# EAGLE design povbadgeUSB-SMT (EAGLE 6.2)
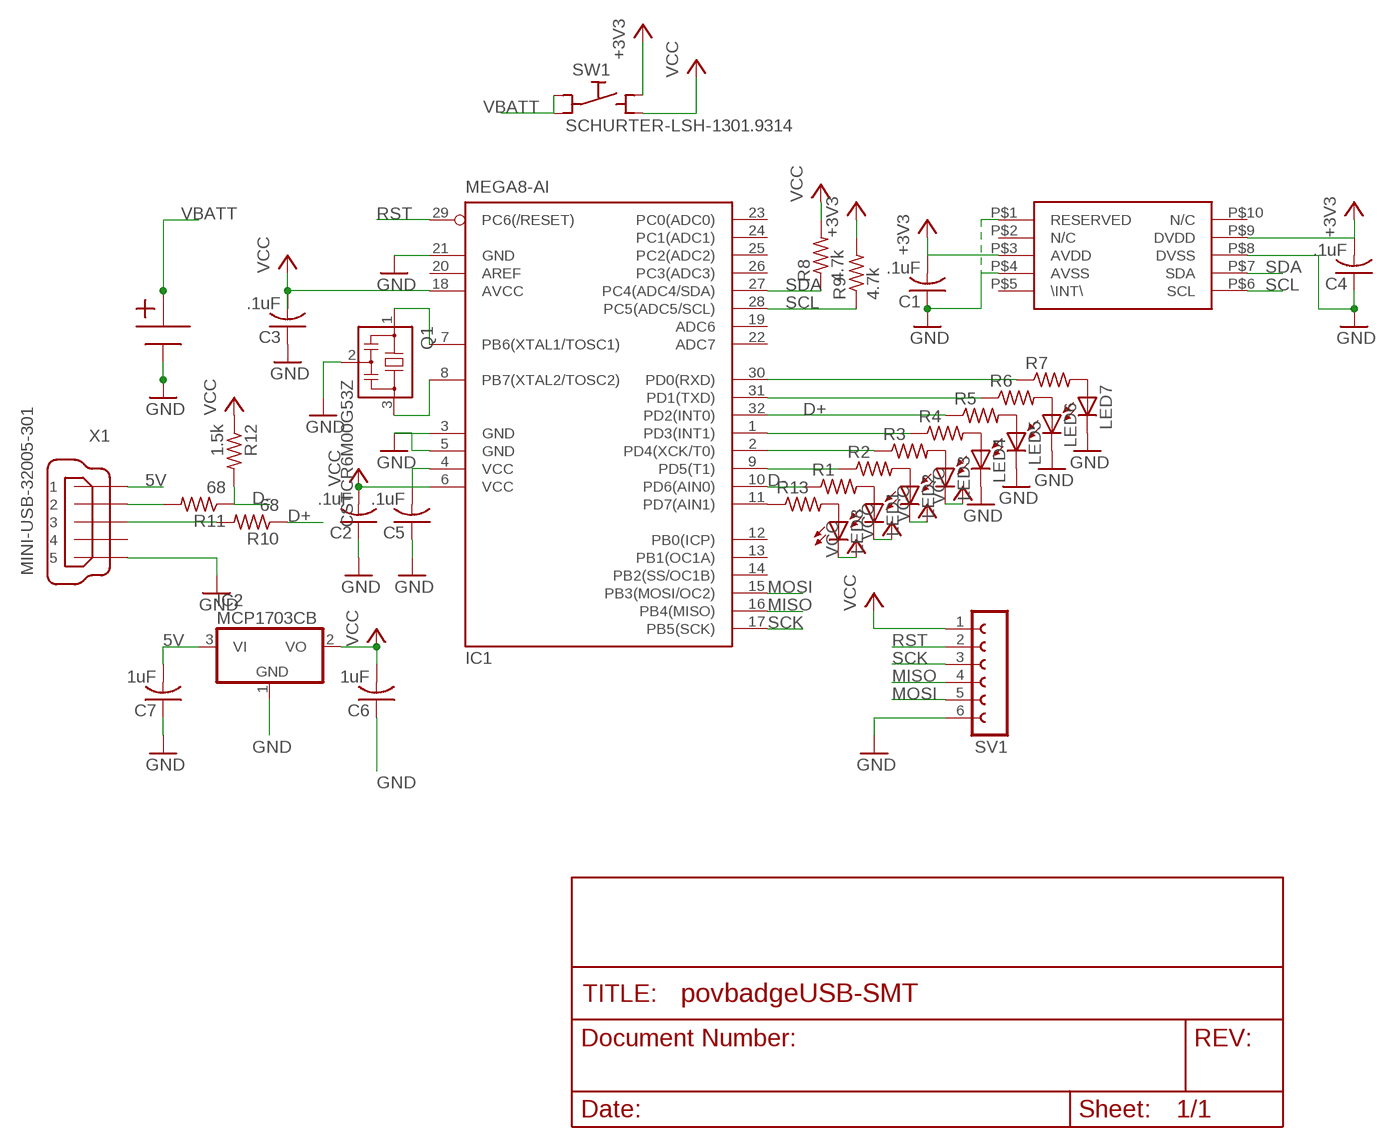
[diagram p0: schematic, sheet 1]

## Parts
C1  .1uF  C-USC0805  [C0805]
C2  .1uF  C-USC0805  [C0805]
C3  .1uF  C-USC0805  [C0805]
C4  .1uF  C-USC0805  [C0805]
C5  .1uF  C-USC0805  [C0805]
C6  1uF  C-USC0805  [C0805]
C7  1uF  C-USC0805  [C0805]
IC1  MEGA8-AI  [TQFP32-08]
IC2  MCP1703CB  [SOT23]
LED1  LEDCHIPLED_0805  [CHIPLED_0805]
LED2  LEDCHIPLED_0805  [CHIPLED_0805]
LED3  LEDCHIPLED_0805  [CHIPLED_0805]
LED4  LEDCHIPLED_0805  [CHIPLED_0805]
LED5  LEDCHIPLED_0805  [CHIPLED_0805]
LED6  LEDCHIPLED_0805  [CHIPLED_0805]
LED7  LEDCHIPLED_0805  [CHIPLED_0805]
LED8  LEDCHIPLED_0805  [CHIPLED_0805]
MMA7660  MMA7660  MMA7660DFN-10-HAND  [DFN-10-HAND]
Q1  CSTCR6M00G53Z  [CSTCR6M]
R1  R-US_R0805  [R0805]
R2  R-US_R0805  [R0805]
R3  R-US_R0805  [R0805]
R4  R-US_R0805  [R0805]
R5  R-US_R0805  [R0805]
R6  R-US_R0805  [R0805]
R7  R-US_R0805  [R0805]
R8  4.7k  R-US_R0805  [R0805]
R9  4.7k  R-US_R0805  [R0805]
R10  68  R-US_R0805  [R0805]
R11  68  R-US_R0805  [R0805]
R12  1.5k  R-US_R0805  [R0805]
R13  R-US_R0805  [R0805]
SV1  FE06W  [FE06W]
SW1  SCHURTER-LSH-1301.9314  [LSH]
U$1  CR2032-CLIP  [CR2032]
X1  MINI-USB-32005-301  [32005-301]

## Nets
5V: C7.2 IC2.3(VI) X1.1
+3V3: C1.2 C4.2 MMA7660.P$3(AVDD) MMA7660.P$9(DVDD) R9.2 SW1.NO1(NO)
D+: IC1.32(PD2(INT0)) R5.1 R10.1
D-: IC1.10(PD6(AIN0)) R1.1 R11.1 R12.2
GND: C1.1 C2.1 C3.1 C4.1 C5.1 C6.1 C7.1 IC1.3(GND) IC1.5(GND) IC1.21(GND) IC2.1(GND) LED4.C LED5.C LED6.C LED7.C MMA7660.P$1(RESERVED) MMA7660.P$4(AVSS) MMA7660.P$8(DVSS) Q1.2 SV1.6 U$1.P$3 X1.5
INT1: IC1.1(PD3(INT1)) R4.1
MISO: IC1.16(PB4(MISO)) SV1.4
MOSI: IC1.15(PB3(MOSI/OC2)) SV1.5
N$1: LED1.A R1.2
N$2: IC1.11(PD7(AIN1)) R13.1
N$3: IC1.8(PB7(XTAL2/TOSC2)) Q1.3
N$4: IC1.7(PB6(XTAL1/TOSC1)) Q1.1
N$5: IC1.9(PD5(T1)) R2.1
N$6: LED8.A R13.2
N$7: LED2.A R2.2
N$8: LED3.A R3.2
N$9: LED4.A R4.2
N$10: LED5.A R5.2
N$11: LED6.A R6.2
N$12: LED7.A R7.2
N$15: R11.2 X1.2
N$16: R10.2 X1.3
RST: IC1.29(PC6(/RESET)) SV1.2
RXD: IC1.30(PD0(RXD)) R7.1
SCK: IC1.17(PB5(SCK)) SV1.3
SCL: IC1.28(PC5(ADC5/SCL)) MMA7660.P$6(SCL) R9.1
SDA: IC1.27(PC4(ADC4/SDA)) MMA7660.P$7(SDA) R8.1
TXD: IC1.31(PD1(TXD)) R6.1
VBATT: SW1.C1(C) SW1.C2(C) U$1.P$1
VCC: C2.2 C3.2 C5.2 C6.2 IC1.4(VCC) IC1.6(VCC) IC1.18(AVCC) IC2.2(VO) LED1.C LED2.C LED3.C LED8.C R8.2 R12.1 SV1.1 SW1.NO2(NO)
XCK: IC1.2(PD4(XCK/T0)) R3.1
Unconnected: IC1.12(PB0(ICP)) IC1.13(PB1(OC1A)) IC1.14(PB2(SS/OC1B)) IC1.19(ADC6) IC1.20(AREF) IC1.22(ADC7) IC1.23(PC0(ADC0)) IC1.24(PC1(ADC1)) IC1.25(PC2(ADC2)) IC1.26(PC3(ADC3)) MMA7660.P$2(N/C) MMA7660.P$5(\INT\) MMA7660.P$10(N/C) U$1.P$2 X1.4

## Library data of the parts
C1-C7 = rcl:C-US: CAPACITOR, American symbol
IC1 = atmel:MEGA8: MICROCONTROLLER 8 Kbytes FLASH, 1 kbytes SRAM, 512 bytes EEPROM, USART, 6-channel 10 bit ADC, 2-channel 8 bit ADC Pin compatible with Atmega48, ATMega88, ATMega168 Source: avr.lbr
IC2 = linear:MCP1703: 250 mA, 16V, Low Quiescent Current LDO Regulator Source: http://ww1.microchip.com/downloads/en/DeviceDoc/22049b.pdf
LED1-LED8 = led:LED: LED OSRAM: - CHIPLED LG R971, LG N971, LY N971, LG Q971, LY Q971, LO R971, LY R971 LH N974, LH R974 LS Q976, LO Q976, LY Q976 LO Q996 - Hyper CHIPLED LW Q18S LB Q993, LB Q99A, LB R99A - SideLED LS A670, LO A670, LY A670, LG A670, LP A670 LB A673, LV A673, LT A673, LW A673 LH A674 LY A675 LS A676, LA A676, LO A676, LY A676, LW A676 LS A679, LY A679, LG A679 - Hyper Micro SIDELED® LS Y876, LA Y876, LO Y876, LY Y876 LT Y87S - SmartLED LW L88C, LW L88S LB L89C, LB L89S, LG L890 LS L89K, LO L89K, LY L89K LS L896, LA L896, LO L896, LY L896 - TOPLED LS T670, LO T670, LY T670, LG T670, LP T670 LSG T670, LSP T670, LSY T670, LOP T670, LYG T670 LG T671, LOG T671, LSG T671 LB T673, LV T673, LT T673, LW T673 LH T674 LS T676, LA T676, LO T676, LY T676, LB T676, LH T676, LSB T676, LW T676 LB T67C, LV T67C, LT T67C, LS T67K, LO T67K, LY T67K, LW E67C LS E67B, LA E67B, LO E67B, LY E67B, LB E67C, LV E67C, LT E67C LW T67C LS T679, LY T679, LG T679 LS T770, LO T770, LY T770, LG T770, LP T770 LB T773, LV T773, LT T773, LW T773 LH T774 LS E675, LA E675, LY E675, LS T675 LS T776, LA T776, LO T776, LY T776, LB T776 LHGB T686 LT T68C, LB T68C - Hyper Mini TOPLED® LB M676 - Mini TOPLED Santana® LG M470 LS M47K, LO M47K, LY M47K Source: http://www.osram.convergy.de LUXEON: - LUMILED® LXK2-PW12-R00, LXK2-PW12-S00, LXK2-PW14-U00, LXK2-PW14-V00 LXK2-PM12-R00, LXK2-PM12-S00, LXK2-PM14-U00 LXK2-PE12-Q00, LXK2-PE12-R00, LXK2-PE12-S00, LXK2-PE14-T00, LXK2-PE14-U00 LXK2-PB12-K00, LXK2-PB12-L00, LXK2-PB12-M00, LXK2-PB14-N00, LXK2-PB14-P00, LXK2-PB14-Q00 LXK2-PR12-L00, LXK2-PR12-M00, LXK2-PR14-Q00, LXK2-PR14-R00 LXK2-PD12-Q00, LXK2-PD12-R00, LXK2-PD12-S00 LXK2-PH12-R00, LXK2-PH12-S00 LXK2-PL12-P00, LXK2-PL12-Q00, LXK2-PL12-R00 Source: www.luxeon.com KINGBRIGHT: KA-3528ASYC Source: www.kingbright.com
MMA7660 = mma7660:MMA7660
Q1 = murata-resonator:CSTCR: Resonator Source: murata.co.jp
R1-R13 = rcl:R-US_: RESISTOR, American symbol
SV1 = con-lsta:FE06W: FEMALE HEADER
SW1 = schurter_switches_LSH_SMS:SCHURTER-LSH-*: Schurter LSH Printmount Switches, Gullwing Leads Momentary Action: Normally Open (NO) 6.0 x 6.0 mm Body Dim. Actuator Diam. mm / Overall Height mm / Schurter # -------------------------------------------------------------- 3.40 / 4.30 / 1301.9314.xx 3.40 / 4.30 / 1301.9315.xx 3.20 / 7.00 / 1301.9316.xx 3.30 / 7.30 / 1301.9317.xx 3.10 / 8.00 / 1301.9319.xx 3.00 / 12.5 / 1301.9320.xx xx: denotes packaging, see Schurter data sheets Author: Dipl.-Ing. FH Rainer Bayer Hochschule Heilbronn HHN: rainer.bayer@hs-heilbronn.de | http://mitarbeiter.hs-heilbronn.de/~rbayer/ Ingenieurbüro ing-rb: mail@ing-rb.de | http://www.ing-rb.de/
U$1 = Battery:CR2032-CLIP
X1 = con-cypressindustries:MINI-USB-: MINI USB-B Conector Source: www.cypressindustries.com; OC_FARNELL: unknown; OC_NEWARK: unknown

## Board
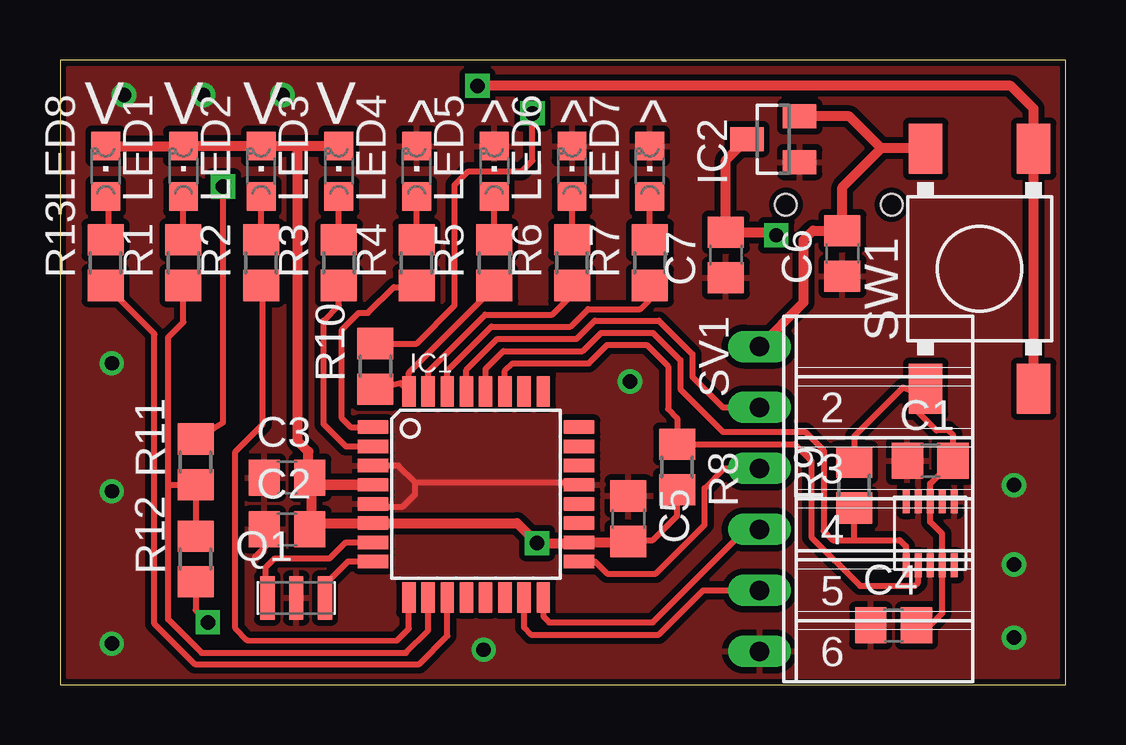
[diagram p1: board, top side]
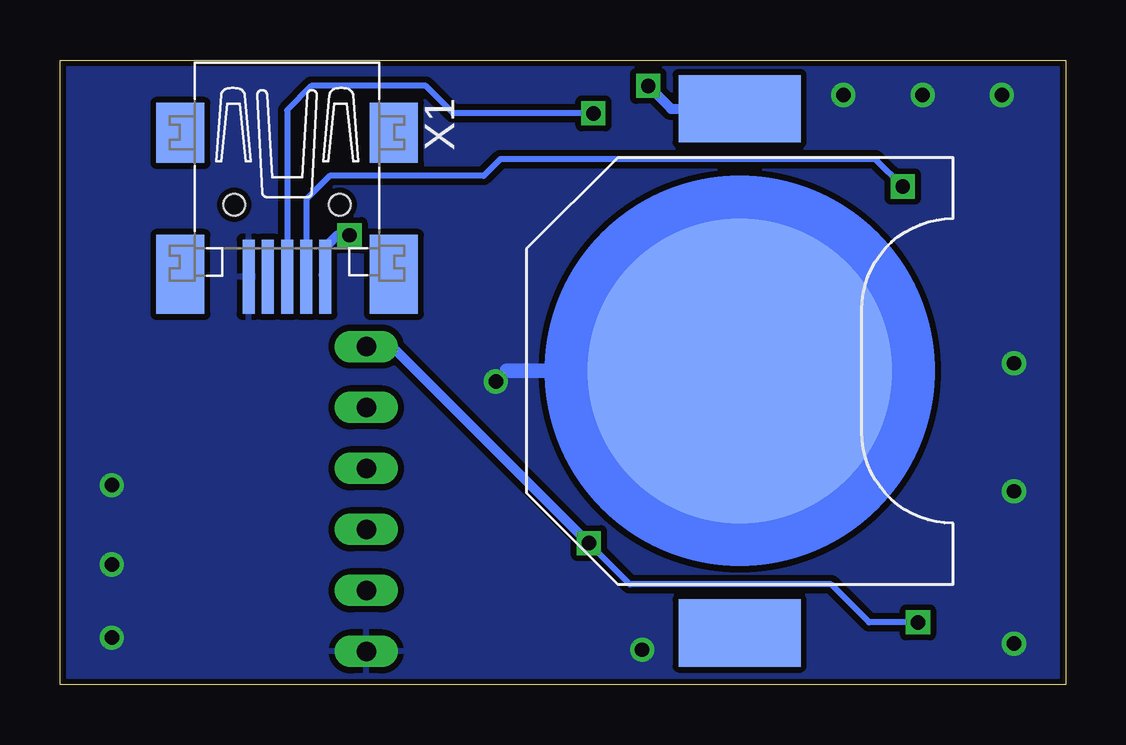
[diagram p2: board, bottom side, seen from below]

Size 41.91 x 26.04 mm. Coordinates in mm from the lower left corner, seen from the top.
Outline: 0,0 41.91,0 41.91,26.04 0,26.04 0,0
Copper layers (1*16): Top 0.035mm / dielectric 1.5mm / Bottom 0.035mm
Design rules: minimum track width 10mil, minimum drill 24mil, track to track 8mil, track to pad 8mil, pad to pad 8mil, via to via 8mil, smd to smd 8mil, copper to edge 0mil, drill to drill 8mil, minimum pad ring 10mil, minimum via ring 8mil, stop-mask expansion 4mil, vias tented up to drill 0mil, thermal gap 10mil

### Footprints (pad centres in the part's own frame; a part is rotated, then mirrored left to right if it is on the bottom)
C0805 = smd 1.3 x 1.5: 1 -0.95,0; 2 0.95,0
TQFP32-08 = smd 1.27 x 0.559: 1 -4.293,2.8; 2 -4.293,2; 3 -4.293,1.2; 4 -4.293,0.4; 5 -4.293,-0.4; 6 -4.293,-1.2; 7 -4.293,-2; 8 -4.293,-2.8; 17 4.293,-2.8; 18 4.293,-2; 19 4.293,-1.2; 20 4.293,-0.4; 21 4.293,0.4; 22 4.293,1.2; 23 4.293,2; 24 4.293,2.8 | smd 0.559 x 1.27: 9 -2.8,-4.293; 10 -2,-4.293; 11 -1.2,-4.293; 12 -0.4,-4.293; 13 0.4,-4.293; 14 1.2,-4.293; 15 2,-4.293; 16 2.8,-4.293; 25 2.8,4.293; 26 2,4.293; 27 1.2,4.293; 28 0.4,4.293; 29 -0.4,4.293; 30 -1.2,4.293; 31 -2,4.293; 32 -2.8,4.293
SOT23 = smd 1 x 1.4: 1 -0.95,-1.1; 2 0.95,-1.1; 3 0,1.1
CHIPLED_0805 = smd 1.2 x 1.2: A 0,-1.05; C 0,1.05
DFN-10-HAND = smd 0.3 x 1: P$1 -1,-1.37; P$2 -0.5,-1.37; P$3 0,-1.37; P$4 0.5,-1.37; P$5 1,-1.37; P$6 1,1.31; P$7 0.5,1.31; P$8 0,1.31; P$9 -0.5,1.31; P$10 -1,1.31
CSTCR6M = smd 0.6 x 1.8: 1 -1.2,0; 2 0,0; 3 1.2,0
R0805 = smd 1.3 x 1.5: 1 -0.95,0; 2 0.95,0
FE06W = drill 0.813 long: 1 -6.35,0; 2 -3.81,0; 3 -1.27,0; 4 1.27,0; 5 3.81,0; 6 6.35,0
LSH = smd 2.1 x 1.4: C1 -5,-2.25; C2 5,-2.25; NO1 -5,2.25; NO2 5,2.25
CR2032 = smd 2.794 x 5.08: P$1 -10.922,0; P$2 10.922,0 | smd 12.7 x 12.7: P$3 0,0
32005-301 = smd 3.1 x 0.5: 1 3,1.6; 2 3,0.8; 3 3,0; 4 3,-0.8; 5 3,-1.6 | smd 2.5 x 2: M1 -3,-4.45; M2 -3,4.45 | smd 3.3 x 2: M3 2.9,4.45; M4 2.9,-4.45 | hole 0.9: 0,2.2; 0,-2.2

### Placement (x,y rotation side)
C1  36.26,9.33 0 top
C2  9.46,6.48 0 top
C3  9.46,8.64 0 top
C4  34.73,2.48 0 top
C5  23.69,6.92 270 top
C6  32.6,17.97 90 top
C7  27.75,17.91 90 top
IC1  17.34,7.94 0 top
IC2  29.72,22.73 90 top
LED1  5.14,21.4 0 top
LED2  8.38,21.4 0 top
LED3  11.62,21.4 0 top
LED4  14.86,21.4 0 top
LED5  18.1,21.4 0 top
LED6  21.34,21.4 0 top
LED7  24.57,21.4 0 top
LED8  1.91,21.4 0 top
MMA7660  36.26,6.29 180 top
Q1  9.84,3.62 0 top
R1  5.14,17.59 90 top
R2  8.38,17.59 90 top
R3  11.62,17.59 90 top
R4  14.86,17.59 90 top
R5  18.1,17.59 90 top
R6  21.34,17.59 90 top
R7  24.57,17.59 90 top
R8  25.72,9.08 270 top
R9  33.08,8.32 90 top
R10  13.14,13.27 90 top
R11  5.65,9.29 90 top
R12  5.65,5.25 90 top
R13  1.91,17.59 90 top
SV1  29.15,7.75 270 top
SW1  38.32,17.34 90 top
U$1  13.59,13.08 270 bottom
X1  32.45,20 270 bottom

### Tracks (layer width: path | path; a pad name or v marks a point on that pad's centre or on a via)
5V  (via drill 0.6)
  Top 0.406: IC2.3 27.75,21.86 C7.2 29.59,18.86 v29.84,18.73
  Bottom 0.406: v29.84,18.73 30.35,18.73 30.92,18.16 30.92,17.08 X1.1
+3V3
  Top 0.254: R9.2 33.08,10.35 35.12,12.38 | C1.2 37.21,10.42 37.02,10.6 36.51,10.6 35.5,11.62 35.5,12.26 35.12,12.38 | C1.2 37.15,9.97 37.15,9.27 36.26,8.38 MMA7660.P$3 36.26,6.79 36.76,6.29 MMA7660.P$9 36.77,4.97 36.77,2.98 36.32,2.54 C4.2 | 35.12,12.38 SW1.NO1 | C1.2 37.4,9.21
D+
  Top 0.254: 18.35,16.7 18.22,16.7 14.54,13.01 IC1.32 14.19,12.57 R10.1 | 18.35,16.7 18.48,16.7 | 18.35,16.7 R5.1
D-
  Top 0.254: R11.1 R12.2 | R11.1 5.65,8.03 | IC1.10 15.34,2.25 14.41,1.33 5.91,1.33 4.51,2.73 4.51,8 | 4.51,8 4.51,14.48 5.14,15.11 R1.1 | R11.1 4.53,8.34 4.51,8
GND  (via drill 0.6)
  Top 0.254: IC1.3 14.1,9.14 14.8,8.45 | 14.8,8.45 14.8,7.94 14.29,7.43 12.9,7.43 IC1.5 | 14.8,8.45 21.27,8.45 IC1.21 | 8.13,5.33 8.64,5.84 8.64,6.35 C2.1
  Bottom 0.406: 23.3,13.08 v23.75,12.64
  Bottom 0.61: U$1.P$3 23.3,13.08
  other vias: 2.16,1.71 2.16,13.4 2.16,8.06 2.67,24.57 5.97,24.57 9.27,24.57 17.65,1.46 39.75,1.97 39.75,5.02 39.75,8.32
  pour Top (isolate 0.254): 0.32,25.72 41.59,25.72 41.59,0.32 0.32,0.32
  pour Bottom (isolate 0.254): 0.32,25.72 41.59,25.72 41.59,0.32 0.32,0.32
INT1
  Top 0.254: 15.18,16.57 R4.1 15.11,16.57 13.91,16.57 12.83,15.49 12.45,15.49 11.75,14.8 11.75,11.11 12.12,10.74 IC1.1
MISO
  Top 0.254: IC1.16 20.14,2.85 20.38,2.6 24.7,2.6 28.57,6.48 SV1.4
MOSI
  Top 0.254: IC1.15 19.34,2.38 19.62,2.1 24.96,2.1 26.8,3.94 SV1.5
N$1
  Top 0.254: R1.2 LED1.A
N$2
  Top 0.254: IC1.11 16.14,2.04 14.96,0.86 5.61,0.86 3.94,2.54 3.94,14.61 R13.1
N$3
  Top 0.254: Q1.3 11.09,4.23 12,5.14 12.78,5.14 IC1.8
N$4
  Top 0.254: IC1.7 11.91,5.94 11.24,5.27 8.95,5.27 8.57,4.89 8.57,3.85 Q1.1
N$5
  Top 0.254: IC1.9 14.54,2.34 14.03,1.84 7.79,1.87 7.3,2.35 7.3,9.72 8.45,10.86 8.45,16.57 R2.1
N$6
  Top 0.254: LED8.A 2.03,20.32 2.03,18.54 R13.2
N$7
  Top 0.254: R2.2 LED2.A
N$8
  Top 0.254: R3.2 LED3.A
N$9
  Top 0.254: R4.2 LED4.A
N$10
  Top 0.254: R5.2 LED5.A
N$11
  Top 0.254: R6.2 LED6.A
N$12
  Top 0.254: R7.2 LED7.A
N$15  (via drill 0.6)
  Top 0.254: R11.2 6.79,10.94 v6.79,20.77
  Bottom 0.254: v6.79,20.77 7.94,21.91 23.56,21.91 24.26,21.21 30.67,21.21 31.65,20.23 X1.2
N$16  (via drill 0.6)
  Top 0.254: R10.2 14.86,14.22 16.45,15.81 16.45,20.83 17.02,21.4 19.24,21.4 19.68,21.84 v19.68,23.81
  Bottom 0.254: v19.68,23.81 25.53,23.81 26.67,24.96 31.43,24.96 32.45,23.94 X1.3
RST
  Top 0.254: IC1.29 16.94,13.13 18.22,14.41 21.53,14.41 22.29,15.18 24.96,15.18 26.35,13.78 26.35,12.83 27.62,11.56 SV1.2
RXD
  Top 0.254: IC1.30 16.14,13.09 17.97,14.92 21.27,14.92 22.01,15.66 24.17,15.66 24.89,16.38 24.96,16.7 R7.1
SCK
  Top 0.254: IC1.17 22.29,5.14 22.8,4.64 24.83,4.64 26.86,6.67 26.86,8.19 27.69,9.02 SV1.3
SCL
  Top 0.254: IC1.28 17.73,13.16 18.48,13.91 21.78,13.91 22.54,14.67 24.7,14.67 25.84,13.53 25.84,12.32 27.62,10.54 31.05,10.54 31.81,9.78 31.81,6.41 32.19,6.03 33.08,6.03 | 33.08,6.03 R9.1 | 33.08,6.03 34.99,6.03 35.24,5.78 35.24,4.99 MMA7660.P$6
SDA
  Top 0.254: IC1.27 18.54,13.09 18.86,13.4 22.04,13.4 22.8,14.16 24.45,14.16 25.34,13.27 25.34,11.49 25.72,11.11 R8.1 26.1,10.03 30.61,10.03 31.3,9.34 31.3,6.16 33.34,4.13 35.62,4.13 35.75,4.25 35.75,4.97 MMA7660.P$7
TXD
  Top 0.254: IC1.31 15.34,13.05 17.72,15.43 20.51,15.43 21.65,16.57 R6.1
VBATT  (via drill 0.6)
  Top 0.406: SW1.C1 SW1.C2 40.57,24.01 39.62,24.96 v17.4,24.96
  Bottom 0.406: v17.4,24.96 16.45,24 U$1.P$1
VCC  (via drill 0.6)
  Top 0.254: IC1.6 12.86,6.67 | R8.2 25.72,7.05 24.7,6.03 24,6.03 C5.2 | R12.1 5.65,3.11 v6.16,2.6
  Top 0.406: C5.2 23.72,5.94 IC1.18 21.34,5.91 v19.88,5.91 19.04,6.74 IC1.6 10.74,6.74 C2.2 10.48,6.54 10.48,8.32 10.5,8.34 IC1.4 10.77,8.34 C3.2 10.48,8.77 10.35,9.21 10.35,9.72 9.91,10.16 9.91,22.39 9.84,22.45 | SW1.NO2 36.02,22.36 34.22,22.36 | LED8.C LED1.C LED2.C 9.84,22.45 | LED3.C 9.84,22.45 | 34.22,22.36 32.89,23.69 IC2.2 | 34.22,22.36 32.6,20.73 C6.2 31.37,18.92 30.99,18.54 30.99,15.94 SV1.1
  Bottom 0.254: v6.16,2.6 8.19,2.6 9.78,4.19 18.16,4.19 v19.88,5.91
  Bottom 0.406: SV1.1 28.07,14.1 v19.88,5.91
XCK
  Top 0.254: IC1.2 11.91,9.94 10.99,10.86 10.99,15.18 11.62,15.81 R3.1

### Text on the board
tPlace: V | V | V | V | ^ | ^ | ^ | ^